# EAGLE design placa1 (EAGLE 7.6.0)
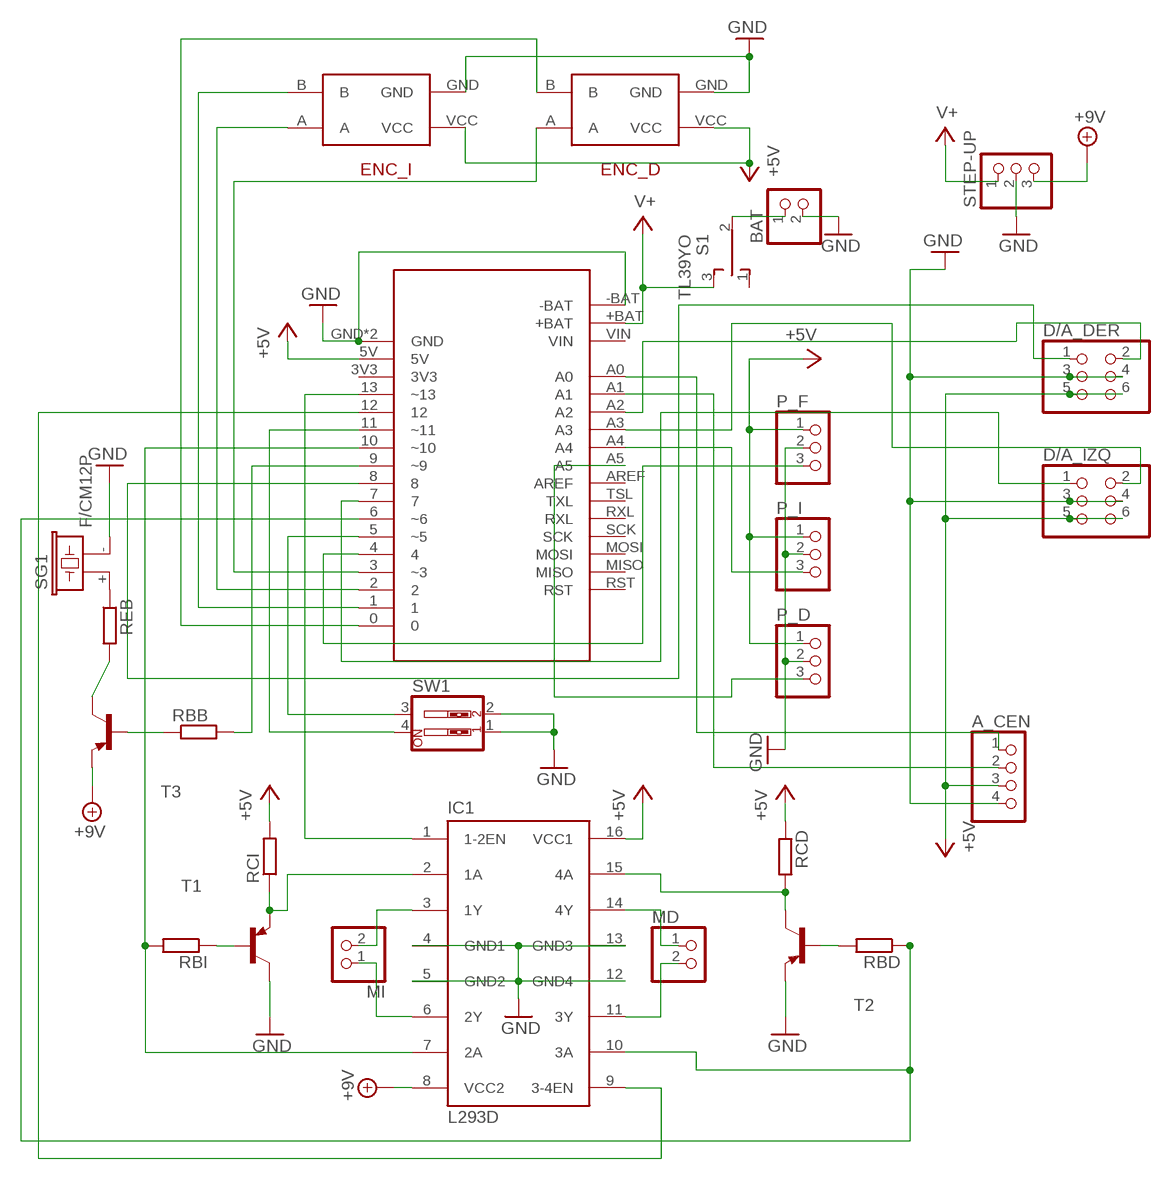
[diagram p0: schematic, sheet 1]

## Parts
A_CEN  PINHD-1X4/90  [1X04/90]
BAT  PINHD-1X2  [1X02]
D/A_DER  PINHD-2X3/90  [2X03/90]
D/A_IZQ  PINHD-2X3/90  [2X03/90]
ENC_D  POLOLU_ENCODER  [POLOLU_ENCODER]
ENC_I  POLOLU_ENCODER  [POLOLU_ENCODER]
IC1  L293D  [DIL16]
MD  PINHD-1X2  [1X02]
MI  PINHD-1X2  [1X02]
P_D  PINHD-1X3/90  [1X03/90]
P_F  PINHD-1X3  [1X03]
P_I  PINHD-1X3/90  [1X03/90]
RBB  R0204/7  [0204/7]
RBD  R0204/7  [0204/7]
RBI  R0204/7  [0204/7]
RCD  R0204/7  [0204/7]
RCI  R0204/7  [0204/7]
REB  R0204/7  [0204/7]
S1  TL39YO  [TL3XYO]
SG1  F/CM12P  [F/CM12P]
STEP-UP  PINHD-1X3  [1X03]
SW1  SW_DIP-2  [EDG-02]
T1  -PNP-TO92-BEC  [TO92-BEC]
T2  -PNP-TO92-BEC  [TO92-BEC]
T3  -PNP-TO92-BEC  [TO92-BEC]
U$1  A-STAR_LV  [A-STAR_LV]

## Nets
+5V: A_CEN.3 D/A_DER.5 D/A_DER.6 D/A_IZQ.5 D/A_IZQ.6 ENC_D.VCC ENC_I.VCC IC1.16(VCC1) P_D.1 P_F.1 P_I.1 RCD.1 RCI.2 U$1.5V
+9V: IC1.8(VCC2) STEP-UP.3 T3.E
GND: A_CEN.4 BAT.2 D/A_DER.3 D/A_DER.4 D/A_IZQ.3 D/A_IZQ.4 ENC_D.GND ENC_I.GND IC1.4(GND1) IC1.5(GND2) IC1.12(GND4) IC1.13(GND3) P_D.2 P_F.2 P_I.2 SG1.- STEP-UP.2 SW1.1 SW1.2 T1.C T2.E U$1.-BAT U$1.GND U$1.GND2(GND)
N$1: BAT.1 S1.2(P)
N$2: IC1.2(1A) RCI.1 T1.E
N$3: RBI.1 T1.B
N$4: RBD.2 T2.B
N$5: IC1.15(4A) RCD.2 T2.C
N$6: IC1.11(3Y) MD.2
N$7: IC1.14(4Y) MD.1
N$8: IC1.7(2A) RBI.2 U$1.10(~10)
N$9: IC1.3(1Y) MI.2
N$10: IC1.6(2Y) MI.1
N$11: IC1.10(3A) RBD.1 U$1.6(~6)
N$12: REB.2 T3.C
N$13: REB.1 SG1.+
N$14: RBB.1 T3.B
N$15: ENC_I.A U$1.2
N$16: ENC_D.B U$1.0
N$17: ENC_I.B U$1.1
N$18: IC1.9(3-4EN) U$1.12
N$19: SW1.3 U$1.5(~5)
N$20: SW1.4 U$1.11(~11)
N$21: RBB.2 U$1.9(~9)
N$22: ENC_D.A U$1.3(~3)
N$23: IC1.1(1-2EN) U$1.13(~13)
N$24: P_F.3 U$1.4
N$25: D/A_IZQ.1 U$1.7
N$26: D/A_DER.1 U$1.8
N$27: A_CEN.1 U$1.A0
N$29: D/A_IZQ.2 U$1.A3
N$30: P_I.3 U$1.A4
N$31: P_D.3 U$1.A5
N$33: A_CEN.2 U$1.A1
N$34: D/A_DER.2 U$1.A2
V+: S1.3(S) STEP-UP.1 U$1.+BAT
Unconnected: S1.1(O) U$1.3V3 U$1.AREF U$1.MISO U$1.MOSI U$1.RST U$1.RXL U$1.SCK U$1.TSL(TXL) U$1.VIN

## Library data of the parts
A_CEN = pinhead:PINHD-1X4: PIN HEADER
BAT MD MI = pinhead:PINHD-1X2: PIN HEADER
D/A_DER D/A_IZQ = pinhead:PINHD-2X3: PIN HEADER
ENC_D ENC_I = Personalizado:POLOLU_ENCODER
IC1 = st-microelectronics:L293D: PUSH-PULL 4 CHANNEL DRIVER; MPN: L293D; OC_FARNELL: 9589619; OC_NEWARK: 56P8249
P_D P_F P_I STEP-UP = pinhead:PINHD-1X3: PIN HEADER
RBB RBD RBI RCD RCI REB = eagle-ltspice:R: RESISTOR, European symbol; SPICEMODEL: NONE; SPICEPREFIX: R
S1 = switch:TL39YO: TINY SWITCH ON OFF ON Source: http://www2.produktinfo.conrad.com/datenblaetter/700000-724999/705152-da-01-de-Subminiaturschalter_TL_36YO.pdf
SG1 = buzzer:F/CM12P: BUZZER Source: Buerklin; OC_FARNELL: unknown; OC_NEWARK: unknown
SW1 = special:SW_DIP-2: DIP SWITCH
T1-T3 = transistor:*-PNP-: PNP Transistror
U$1 = Personalizado:A-STAR_LV

## Board
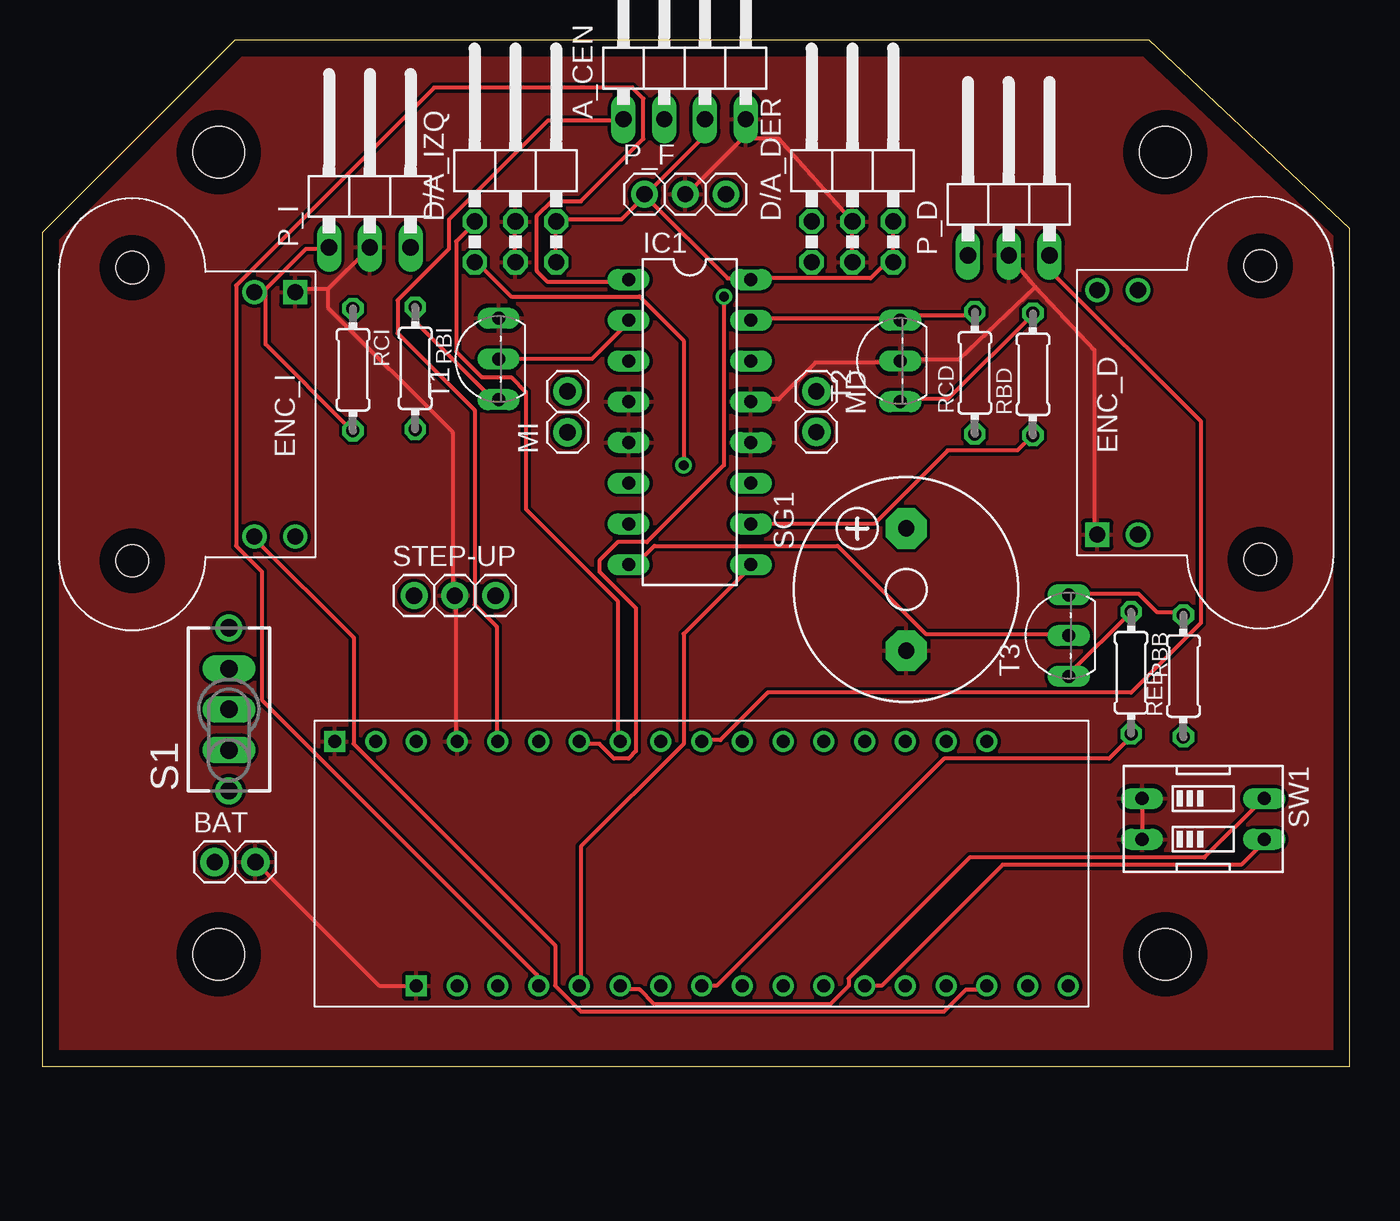
[diagram p1: board, top side]
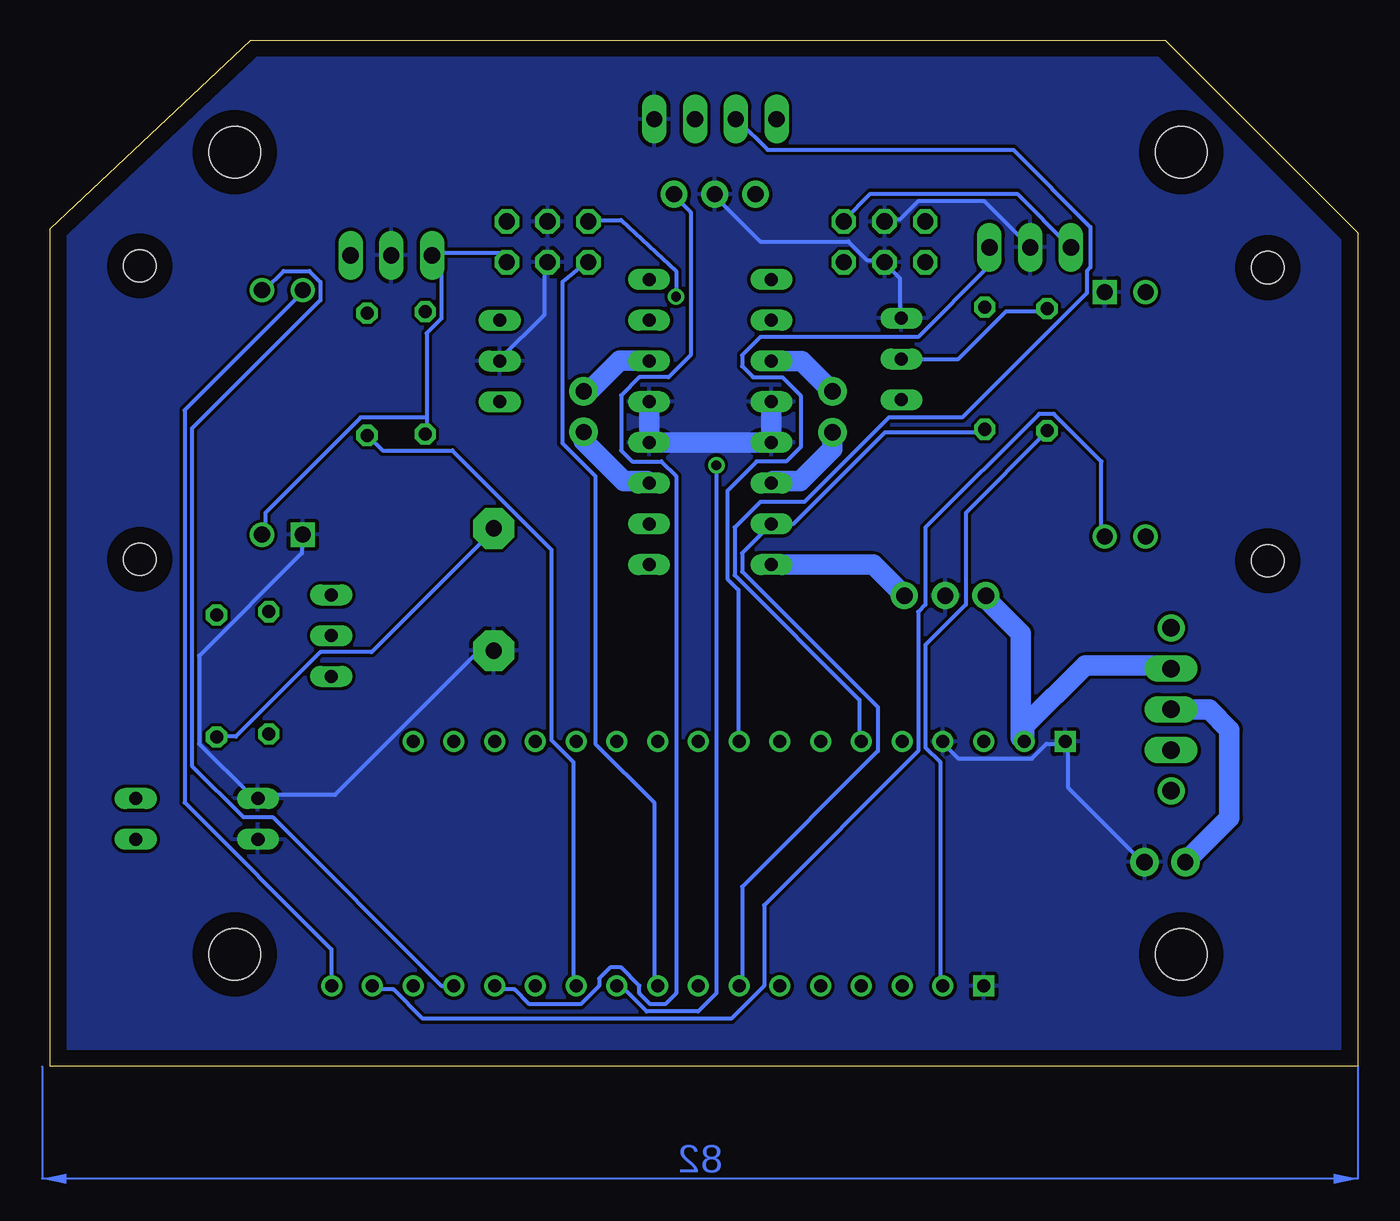
[diagram p2: board, bottom side, seen from below]

Size 81.5 x 64 mm. Coordinates in mm from the lower left corner, seen from the top.
Outline: 69,64 12,64 0,52 0,0 81.5,0 81.5,52.25 69,64
Copper layers (1*16): Top 0.035mm / dielectric 1.5mm / Bottom 0.035mm
Design rules "default": minimum track width 10mil, minimum drill 24mil, track to track 8mil, track to pad 8mil, pad to pad 8mil, via to via 8mil, smd to smd 8mil, copper to edge 40mil, drill to drill 8mil, minimum pad ring 10mil, minimum via ring 8mil, stop-mask expansion 4mil, vias tented up to drill 0mil, thermal gap 10mil
Holes 3.2 mm at 11,7 70,7 70,57 11,57

### Footprints (pad centres in the part's own frame; a part is rotated, then mirrored left to right if it is on the bottom)
1X04/90 = drill 1.016 long: 1 -3.81,-3.81; 2 -1.27,-3.81; 3 1.27,-3.81; 4 3.81,-3.81
1X02 = drill 1.016 pad 1.778: 1 -1.27,0; 2 1.27,0
2X03/90 = drill 1.016 octagon: 1 -2.54,-6.35; 2 -2.54,-3.81; 3 0,-6.35; 4 0,-3.81; 5 2.54,-6.35; 6 2.54,-3.81
POLOLU_ENCODER = drill 1: A 7.62,3.81; B 7.62,6.35; VCC -7.62,3.81 | drill 1 square: GND -7.62,6.35 | hole 2: -9.144,-3.81; 9.144,-3.81
DIL16 = drill 0.813 long: 1 -8.89,-3.81; 2 -6.35,-3.81; 3 -3.81,-3.81; 4 -1.27,-3.81; 5 1.27,-3.81; 6 3.81,-3.81; 7 6.35,-3.81; 8 8.89,-3.81; 9 8.89,3.81; 10 6.35,3.81; 11 3.81,3.81; 12 1.27,3.81; 13 -1.27,3.81; 14 -3.81,3.81; 15 -6.35,3.81; 16 -8.89,3.81
1X03/90 = drill 1.016 long: 1 -2.54,-3.81; 2 0,-3.81; 3 2.54,-3.81
1X03 = drill 1.016 pad 1.676: 1 -2.54,0; 2 0,0; 3 2.54,0
0204/7 = drill 0.813 octagon: 1 -3.81,0; 2 3.81,0
TL3XYO = drill 1.1 pad 1.422 long: 1 -2.54,0; 2 0,0; 3 2.54,0 | drill 1.1 pad 1.676: M1 -5.08,0; M2 5.08,0
F/CM12P = drill 1.016 pad 2.54 octagon: + 3.81,0; - -3.81,0
EDG-02 = drill 0.813 long: 1 -1.27,-3.81; 2 1.27,-3.81; 3 1.27,3.81; 4 -1.27,3.81
TO92-BEC = drill 0.813 long: B -2.54,0; C 2.54,0; E 0,0
A-STAR_LV = drill 0.8: 0 -3.81,-34.29; 1 -3.81,-31.75; 2 -3.81,-29.21; 3 -3.81,-26.67; 3V3 -3.81,1.27; 4 -3.81,-24.13; 5 -3.81,-21.59; 5V -3.81,3.81; 6 -3.81,-19.05; 7 -3.81,-16.51; 8 -3.81,-13.97; 9 -3.81,-11.43; 10 -3.81,-8.89; 11 -3.81,-6.35; 12 -3.81,-3.81; 13 -3.81,-1.27; +BAT 11.43,8.89; A0 11.43,1.27; A1 11.43,-1.27; A2 11.43,-3.81; A3 11.43,-6.35; A4 11.43,-8.89; A5 11.43,-11.43; AREF 11.43,-13.97; GND2 11.43,3.81; MISO 11.43,-26.67; MOSI 11.43,-24.13; RST 11.43,-29.21; RXL 11.43,-19.05; SCK 11.43,-21.59; TSL 11.43,-16.51; VIN 11.43,6.35 | drill 0.8 square: -BAT 11.43,11.43; GND -3.81,6.35

### Placement (x,y rotation side)
A_CEN  40.04,62.88 0 top
BAT  12.02,12.75 0 top
D/A_DER  50.5,56.5 0 top
D/A_IZQ  29.5,56.5 0 top
ENC_D  72.11,40.78 90 top
ENC_I  9.42,40.67 270 top
IC1  40.36,40.18 270 top
MD  48.25,40.83 270 top
MI  32.75,40.82 90 top
P_D  60.24,54.39 0 top
P_F  40.08,54.39 0 top
P_I  20.42,54.89 0 top
RBB  67.87,24.55 270 top
RBD  61.75,43.16 90 top
RBI  23.25,43.54 270 top
RCD  58.13,43.25 90 top
RCI  19.37,43.45 270 top
REB  71.13,24.35 90 top
S1  11.64,22.27 90 top
SG1  53.85,29.74 90 top
STEP-UP  25.72,29.36 0 top
SW1  72.36,15.44 270 top
T1  28.45,44.11 90 top
T2  53.48,43.99 90 top
T3  63.98,26.87 90 top
U$1  29.67,8.83 90 top

### Tracks (layer width: path | path; a pad name or v marks a point on that pad's centre or on a via)
+5V
  Top 0.254: 13.92,48.47 13.23,48.47 ENC_I.VCC 13.92,48.47 | 13.92,48.47 16.43,50.98 17.8,50.98 P_I.1 | 13.92,48.47 13.92,45.04 19.18,39.78 RCI.2 | D/A_IZQ.5 31.98,50.29 31.98,52.58 D/A_IZQ.6 32.21,52.81 36.09,52.81 37.46,54.18 P_F.1 | P_F.1 37.69,54.18 42.72,49.15 44.09,49.15 IC1.16 44.32,49.15 51.64,49.15 53.01,50.52 D/A_DER.5 53.01,50.75 53.01,53.04 D/A_DER.6 | A_CEN.3 41.12,58.98 41.12,57.84 37.69,54.41 P_F.1
  Bottom 0.254: U$1.5V 26.03,5.03 26.03,18.98 26.95,19.89 26.95,26.29 24.43,28.81 24.43,34.52 19.41,39.55 RCI.2 | 58.04,40.46 58.04,45.72 57.12,46.64 57.12,50.75 | 58.04,40.46 58.04,39.55 RCD.1 | 57.12,50.75 57.12,50.98 57.58,51.44 P_D.1 57.12,50.75 | 58.04,40.46 62.15,40.46 68.1,34.52 68.1,33.38 ENC_D.VCC | 57.12,50.75 53.24,50.75 D/A_DER.5 | P_I.1 18.03,51.21 21.23,54.41 30.38,54.41 31.98,52.81 D/A_IZQ.6
+9V
  Top 0.254: T3.E 63.75,26.98 55.07,26.98 49.58,32.46 38.15,32.46 36.78,31.09 IC1.8
  Bottom 1.27: STEP-UP.3 30.19,31.29 IC1.8
GND
  Top 0.254: U$1.GND2 25.81,20.35 25.81,29.26 STEP-UP.2 25.58,29.49 25.58,39.55 17.8,47.32 17.8,48.47 | U$1.GND 23.29,5.03 21.01,5.03 13.46,12.57 BAT.2 | SW1.2 68.55,16.69 SW1.1 | 61.9,48.61 60.32,50.44 P_D.2 | 61.9,48.61 65.58,44.68 65.58,33.38 ENC_D.GND | D/A_IZQ.4 29.46,52.58 29.46,50.29 D/A_IZQ.3 | 17.8,48.47 15.98,48.47 ENC_I.GND | 17.8,48.47 20.32,50.98 P_I.2 | 43.64,57.84 43.64,58.98 A_CEN.4 43.64,57.84 | 43.64,57.84 40.21,54.41 P_F.2 | D/A_DER.3 50.49,50.75 50.49,52.54 D/A_DER.4 49.99,53.27 45.92,57.84 43.64,57.84 | IC1.13 44.32,41.61 45.92,41.61 48.21,43.89 53.47,43.89 T2.E 53.69,44.12 57.17,44.12 61.9,48.61
  Bottom 0.254: U$1.GND2 25.81,20.12 24.89,19.2 20.32,19.2 19.41,20.12 18.26,20.12 U$1.-BAT 18.03,20.12 18.03,17.38 13.46,12.8 BAT.2 | SG1.- 53.92,25.83 54.84,25.83 63.75,16.92 68.33,16.92 SW1.1 68.55,16.92 69.01,16.92 72.21,20.12 72.21,25.6 65.81,32.01 65.81,33.15 ENC_D.GND | T1.C 28.55,46.87 28.55,49.15 29.46,50.06 D/A_IZQ.3 29.69,50.29 30.61,50.29 31.75,51.44 37.24,51.44 39.98,54.18 P_F.2 | D/A_IZQ.4 29.46,52.81 28.55,52.81 27.41,53.95 23.29,53.95 20.55,51.21 P_I.2 | T2.E 53.47,44.12 50.72,46.87 50.72,50.02 D/A_DER.3
  Bottom 1.27: IC1.13 IC1.12 IC1.5 IC1.4
  pour Bottom: 1,53 12,64 69,64 81,53 81,0 1,0
  pour Top: 1,53 12,64 69,64 81,53 81,0 1,0
N$1
  Bottom 1.27: BAT.1 8,15.5 8,21 9.27,22.27 S1.2
N$2
  Top 0.254: T1.E 28.55,44.12 34.26,44.12 36.55,46.41 IC1.2
  Bottom 0.254: RCI.1 19.41,47.09 21.92,47.09 24.89,44.12 28.32,44.12 T1.E
N$3
  Top 0.254: RBI.1 23.29,47.32 23.29,46.41 28.32,41.38 T1.B
N$4
  Top 0.254: T2.B 53.69,41.61 56.44,41.61 61.7,46.87 RBD.2
N$5
  Top 0.254: IC1.15 44.32,46.64 53.47,46.64 T2.C 53.69,46.64 53.92,46.87 58.04,46.87 RCD.2
N$6
  Bottom 1.27: IC1.11 44.3,36.5 45.75,36.5 48.25,39 MD.2
N$7
  Bottom 1.27: IC1.14 46,44 47.9,42.1 MD.1
N$8
  Bottom 0.254: U$1.10 38.38,5.03 38.38,11.2 29.92,19.66 29.92,22.41 38.38,30.86 38.38,32.01 36.78,33.61 IC1.7 35.18,33.84 29.46,39.55 23.29,39.55 RBI.2
N$9
  Bottom 1.27: MI.2 34.65,43.99 IC1.3
N$10
  Bottom 1.27: IC1.6 36.42,36.5 34.75,36.5 32.75,38.5 MI.1
N$11
  Top 0.254: IC1.10 44.32,33.84 51.87,33.84 56.44,38.41 60.78,38.41 61.7,39.32 RBD.1
  Bottom 0.254: U$1.6 48.89,5.03 48.89,18.98 50.27,20.35 50.27,32.23 56.44,38.41 60.78,38.41 61.7,39.32 RBD.1
N$12
  Top 0.254: REB.2 71.07,28.35 69.47,28.35 68.33,29.49 63.98,29.49 T3.C
N$13
  Bottom 0.254: REB.1 71.07,20.58 69.92,20.58 64.67,25.83 61.47,25.83 53.92,33.38 SG1.+
N$14
  Top 0.254: T3.B 63.98,24.46 67.87,28.35 RBB.1
N$15
  Top 0.254: U$1.2 58.72,4.8 57.58,4.8 56.21,3.43 33.58,3.43 31.98,5.03 31.98,7.55 19.41,20.12 19.41,26.75 13.23,32.92 ENC_I.A
N$16
  Bottom 0.254: U$1.0 63.98,5.03 63.98,7.32 73.13,16.46 73.13,40.92 65.81,48.24 ENC_D.B
N$17
  Bottom 0.254: U$1.1 61.24,4.8 60.1,4.8 58.27,2.97 39.06,2.97 37.01,5.03 37.01,10.06 27.41,19.66 27.41,28.35 26.95,28.81 26.95,33.61 19.86,40.69 18.95,40.69 15.98,37.72 15.98,33.15 ENC_I.B
N$18
  Top 0.254: U$1.12 33.58,5.03 33.58,13.72 39.98,20.12 39.98,26.98 44.09,31.09 IC1.9
N$19
  Top 0.254: U$1.5 51.41,5.03 52.32,5.03 59.87,12.57 74.73,12.57 76.1,13.95 SW1.3
N$20
  Top 0.254: U$1.11 36.09,4.8 37.24,4.8 38.15,3.89 49.12,3.89 50.27,5.03 50.27,5.49 57.81,13.03 72.44,13.03 76.1,16.69 SW1.4
N$21
  Top 0.254: U$1.9 41.12,5.03 42.04,5.03 56.21,19.2 66.5,19.2 67.87,20.58 RBB.2
N$22
  Bottom 0.254: U$1.3 56.44,5.03 57.12,5.03 67.64,15.55 69.47,15.55 72.67,18.75 72.67,39.78 64.67,47.78 64.67,48.92 65.35,49.61 66.95,49.61 68.1,48.47 ENC_D.A
N$23
  Top 0.254: U$1.13 30.84,5.03 30.84,5.72 13.69,22.86 13.69,30.86 12.09,32.46 12.09,48.69 24.43,61.04 36.78,61.04 37.46,60.35 37.46,57.84 33.58,53.95 31.75,53.95 30.84,53.04 30.84,49.61 31.52,48.92 36.55,48.92 IC1.1
N$24
  Bottom 0.254: U$1.4 53.69,4.8 52.55,4.8 51.64,3.89 48.44,3.89 47.29,5.03 47.29,5.49 46.61,6.17 45.92,6.17 44.78,5.03 44.78,4.57 44.09,3.89 43.18,3.89 42.49,4.57 42.49,36.81 43.41,37.72 45.24,37.72 45.92,38.41 45.92,41.84 44.78,42.98 42.95,42.98 41.58,44.35 41.58,53.27 42.49,54.18 P_F.3
N$25  (via drill 0.61)
  Top 0.254: v39.98,37.49 39.98,45.27 37.24,48.01 29.23,48.01 27.18,50.06 D/A_IZQ.1
  Bottom 0.254: v39.98,37.49 39.98,4.57 41.12,3.43 44.32,3.43 45.69,4.8 46.15,4.8 U$1.7
N$26
  Bottom 0.254: U$1.8 43.87,5.03 43.87,16.46 47.52,20.12 47.52,36.81 49.58,38.86 49.58,48.92 48.23,50.02 D/A_DER.1
N$27
  Top 0.254: U$1.A0 28.32,20.35 28.32,27.43 26.95,28.81 26.95,40.92 22.15,45.72 22.15,47.78 25.35,50.98 25.35,52.81 31.52,58.98 36.09,58.98 A_CEN.1
N$29
  Top 0.254: U$1.A3 35.86,20.35 35.86,29.03 30.15,34.75 30.15,42.06 29.23,42.98 27.41,42.98 25.81,44.58 25.81,51.44 26.95,52.58 D/A_IZQ.2
N$30
  Bottom 0.254: U$1.A4 38.61,20.35 38.61,29.72 39.29,30.41 39.29,35.89 37.46,37.72 35.63,37.72 34.72,38.63 34.72,41.84 35.86,42.98 37.69,42.98 38.38,43.66 38.38,44.35 37.24,45.49 27.41,45.49 23.06,49.84 23.06,50.98 P_I.3
N$31
  Top 0.254: U$1.A5 41.12,20.35 42.27,20.35 45.24,23.32 67.87,23.32 72.21,27.66 72.21,40.24 62.84,49.61 62.84,50.44 P_D.3
N$33
  Bottom 0.254: U$1.A1 31.06,20.35 31.06,22.86 38.84,30.63 38.84,33.61 37.24,35.21 34.49,35.21 29.23,40.46 24.66,40.46 16.89,48.24 16.89,49.61 16.66,49.84 16.66,52.35 21.46,57.15 36.78,57.15 38.61,58.98 A_CEN.2
N$34  (via drill 0.61)
  Top 0.254: v42.49,48.01 42.49,37.49 37.69,32.69 35.86,32.69 34.72,31.55 34.72,30.86 37.01,28.58 37.01,19.66 36.55,19.2 35.63,19.2 34.72,20.12 33.58,20.12 U$1.A2
  Bottom 0.254: v42.49,48.01 42.49,49.61 45.92,52.79 48,52.79 D/A_DER.2
V+
  Bottom 1.27: S1.3 11.83,25 17,25 20.78,21.22 U$1.+BAT 21,20.48 21,27 23.18,29.18 STEP-UP.1
(copper drawn outside any net)
  shapes: Bottom area x1